# EAGLE schematic feederschematic (EAGLE 9.0.0)
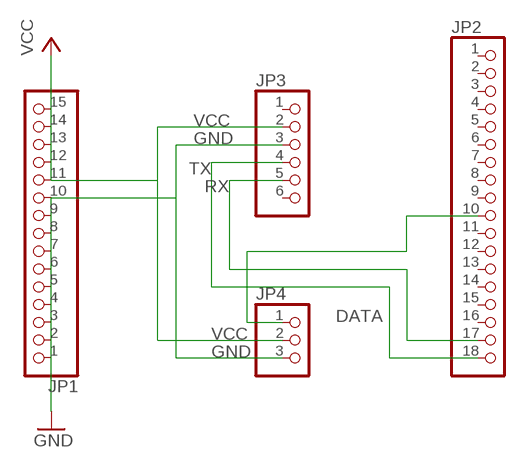
[diagram p0: schematic, sheet 1]

## Parts
JP1  PINHD-1X15  [1X15]
JP2  PINHD-1X18  [1X18]
JP3  PINHD-1X6  [1X06]
JP4  PINHD-1X3  [1X03]

## Nets
DATA: JP2.10 JP4.1
GND: JP1.10 JP3.3 JP4.3
RX: JP2.17 JP3.5
TX: JP2.18 JP3.4
VCC: JP1.11 JP3.2 JP4.2
Unconnected: JP1.1 JP1.2 JP1.3 JP1.4 JP1.5 JP1.6 JP1.7 JP1.8 JP1.9 JP1.12 JP1.13 JP1.14 JP1.15 JP2.1 JP2.2 JP2.3 JP2.4 JP2.5 JP2.6 JP2.7 JP2.8 JP2.9 JP2.11 JP2.12 JP2.13 JP2.14 JP2.15 JP2.16 JP3.1 JP3.6

## Library data of the parts
JP1 = pinhead:PINHD-1X15: PIN HEADER
JP2 = pinhead:PINHD-1X18: PIN HEADER
JP3 = pinhead:PINHD-1X6: PIN HEADER
JP4 = pinhead:PINHD-1X3: PIN HEADER